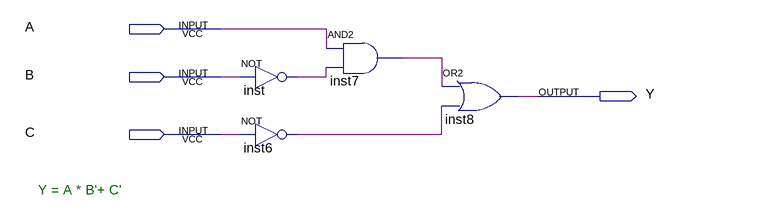
[diagram p0: schematic sheet]
// Quartus schematic Lab0_PARKERRUBIN.bdf as structural Verilog: 4 symbols, 4 pins
module Lab0_PARKERRUBIN (
  input  A,
  input  B,
  input  C,
  output Y
);

  wire inst6_out, inst7_out, inst_out;

  not inst (inst_out, B);
  not inst6 (inst6_out, C);
  and inst7 (inst7_out, A, inst_out);
  or inst8 (Y, inst7_out, inst6_out);

  // Notes on the sheet:
  //   Y = A * B'+ C'
endmodule
